# EAGLE schematic PR-Modem-PY (EAGLE 6.3)
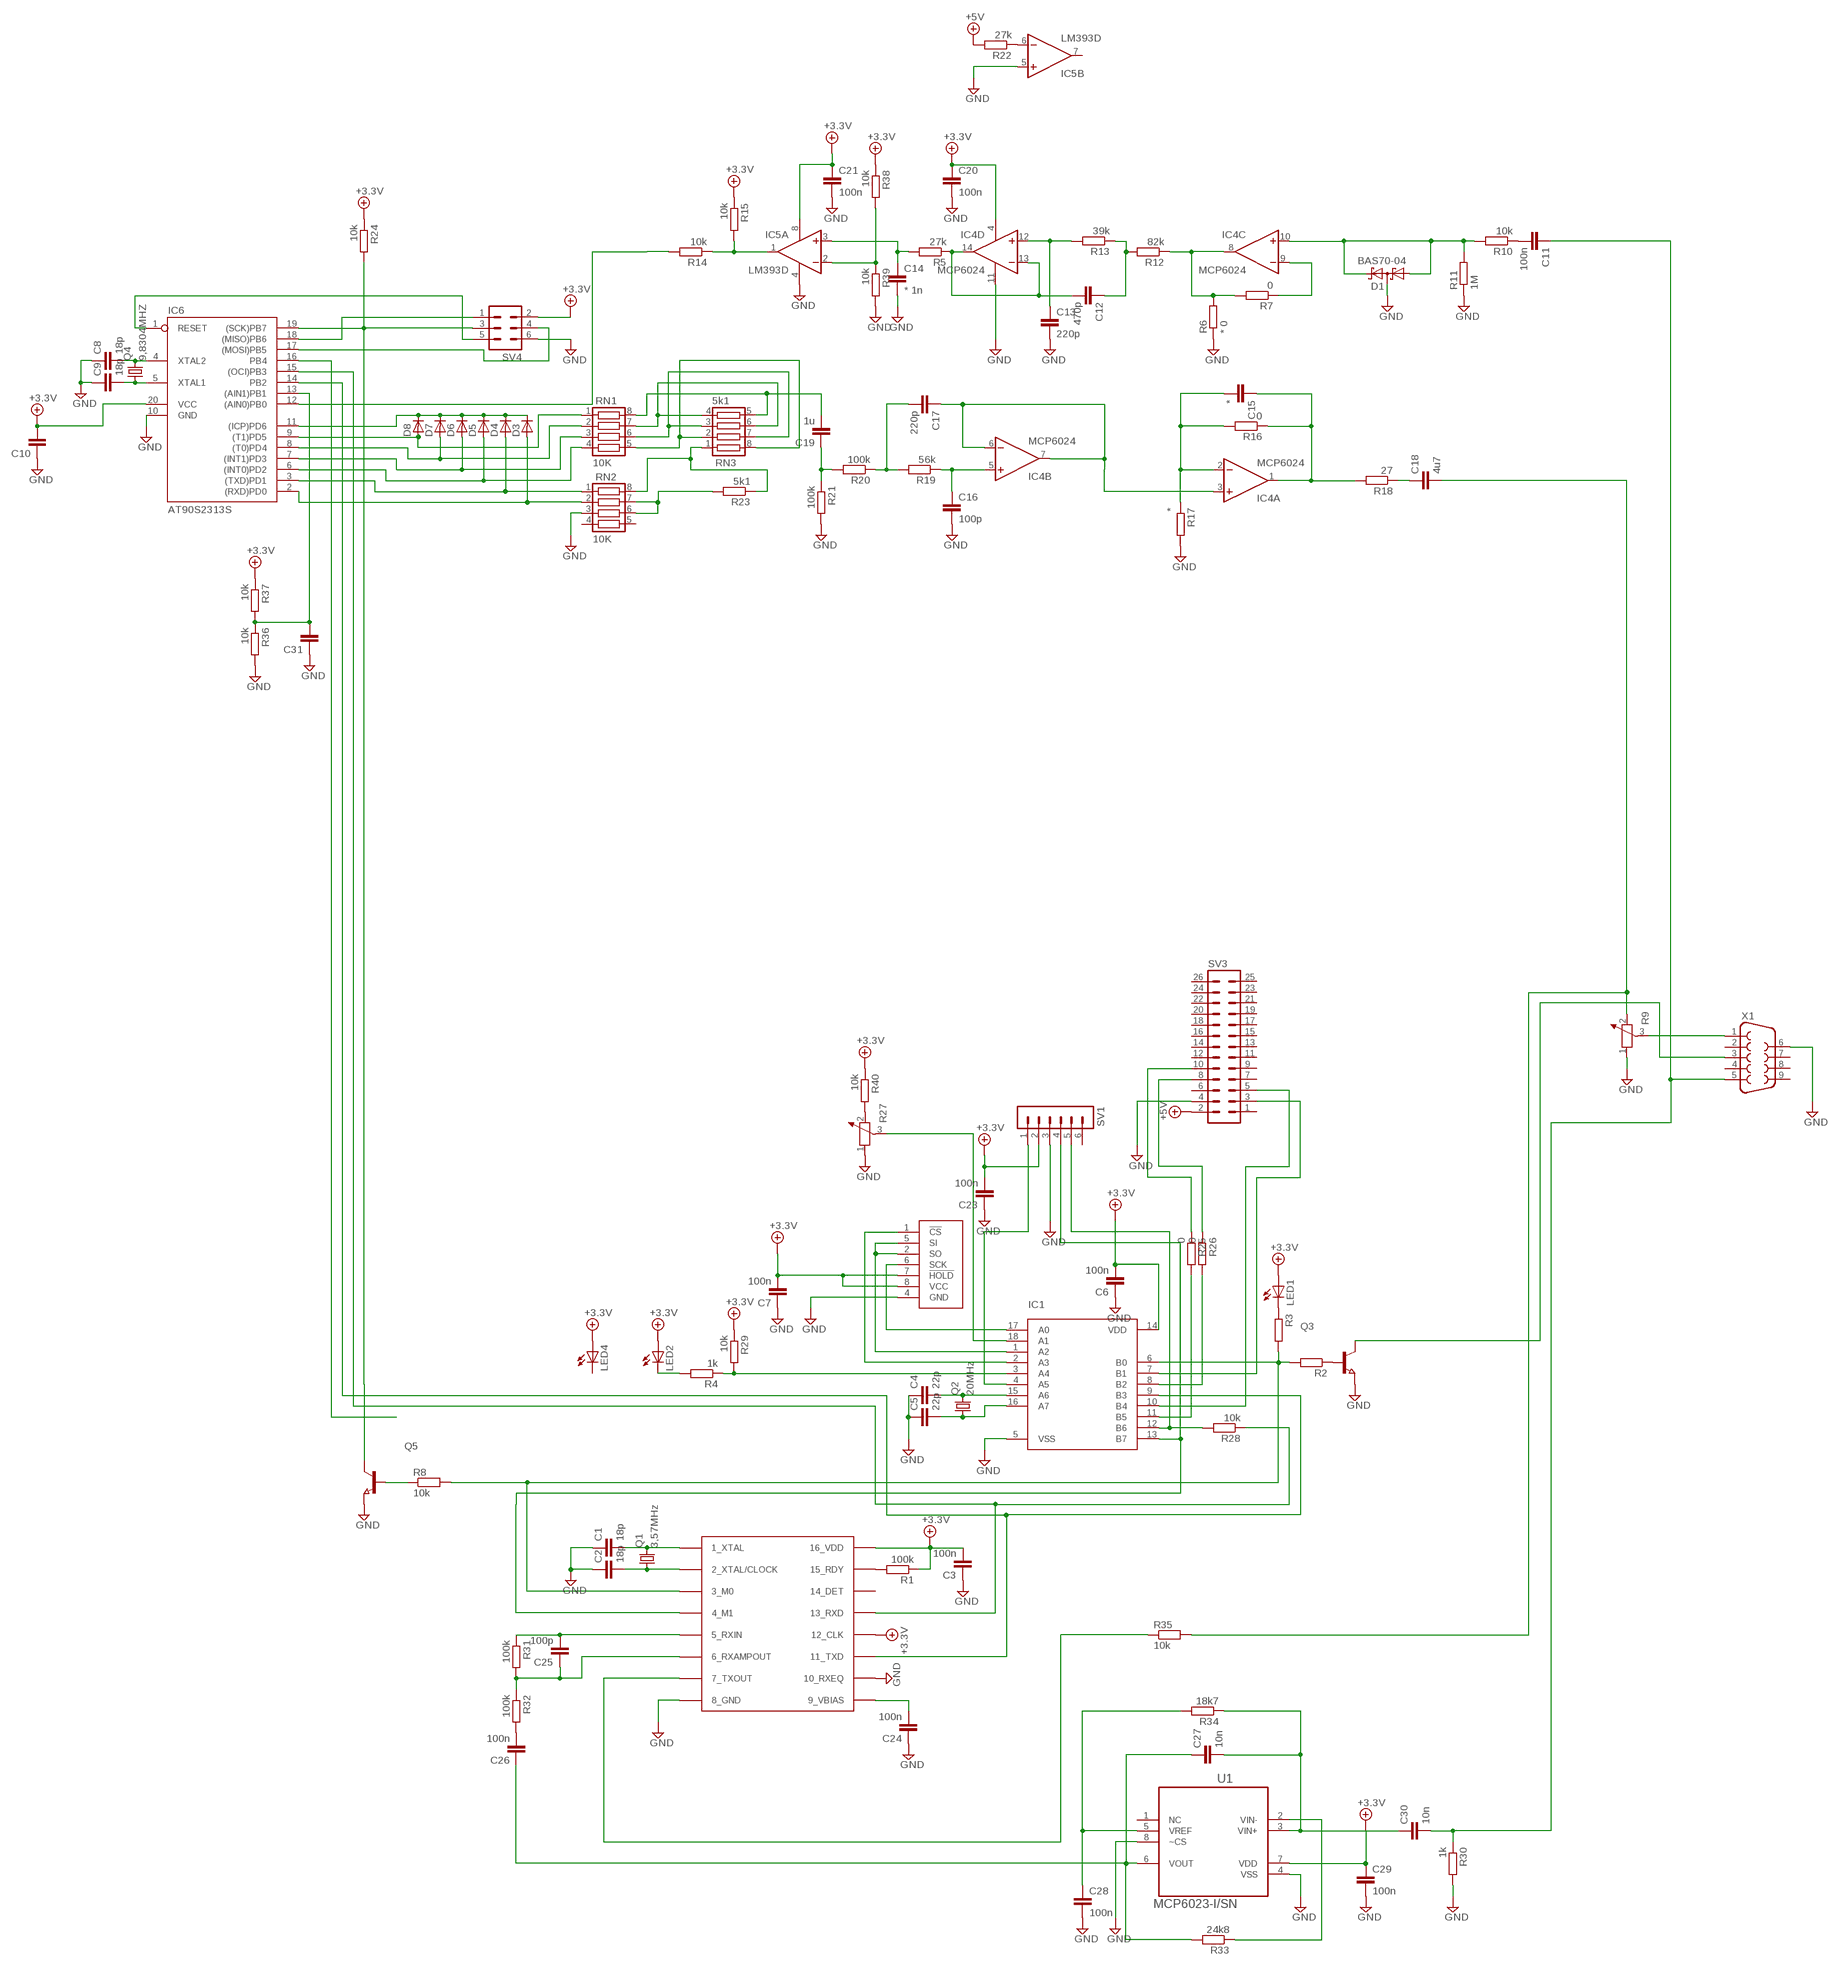
[diagram p0: schematic, sheet 1]

## Parts
C1  18p  C-EUC0603  [C0603]
C2  18p  C-EUC0603  [C0603]
C3  100n  C-EUC0603  [C0603]
C4  22p  C-EUC0603  [C0603]
C5  22p  C-EUC0603  [C0603]
C6  100n  C-EUC0603  [C0603]
C7  100n  C-EUC0603  [C0603]
C8  18p  C-EUC0603  [C0603]
C9  18p  C-EUC0603  [C0603]
C10  C-EUC0603  [C0603]
C11  100n  C-EUC0603  [C0603]
C12  470p  C-EUC0603  [C0603]
C13  220p  C-EUC0603  [C0603]
C14  * 1n  C-EUC0603  [C0603]
C15  *  C-EUC0603  [C0603]
C16  100p  C-EUC0603  [C0603]
C17  220p  C-EUC0603  [C0603]
C18  4u7  C-EUC1210  [C1210]
C19  1u  C-EUC1210  [C1210]
C20  100n  C-EUC0603  [C0603]
C21  100n  C-EUC0603  [C0603]
C23  100n  C-EUC0603  [C0603]
C24  100n  C-EUC0603  [C0603]
C25  100p  C-EUC0603  [C0603]
C26  100n  C-EUC0603  [C0603]
C27  10n  C-EUC0603  [C0603]
C28  100n  C-EUC0603  [C0603]
C29  100n  C-EUC0603  [C0603]
C30  10n  C-EUC0603  [C0603]
C31  C-EUC0603  [C0603]
D1  BAS70-04  [SOT23]
D3  D-SOD123  [SOD123]
D4  D-SOD123  [SOD123]
D5  D-SOD123  [SOD123]
D6  D-SOD123  [SOD123]
D7  D-SOD123  [SOD123]
D8  D-SOD123  [SOD123]
IC1  PIC16F18X7SO  [SOIC18-W]
IC4  MCP6024  TL064D  [SO14]
IC5  LM393D  [SO08]
IC6  AT90S2313S  [SO20L]
LED1  LED3MM  [LED3MM]
LED2  LED3MM  [LED3MM]
LED4  LED3MM  [LED3MM]
Q1  3,57MHz  CRYSTALHC49S  [HC49/S]
Q2  20MHz  CRYSTALHC49S  [HC49/S]
Q3  NPN-TRANSISTOR_SOT23  [SOT23]
Q4  9,8304MHZ  CRYSTALHC49S  [HC49/S]
Q5  NPN-TRANSISTOR_SOT23  [SOT23]
R1  100k  R-EU_R0603  [R0603]
R2  R-EU_R0603  [R0603]
R3  R-EU_R0603  [R0603]
R4  1k  R-EU_R0603  [R0603]
R5  27k  R-EU_R0603  [R0603]
R6  * 0  R-EU_R0603  [R0603]
R7  0  R-EU_R0603  [R0603]
R8  10k  R-EU_R0603  [R0603]
R9  POTENTIOMETER_PT-10  [PT-10]
R10  10k  R-EU_R0603  [R0603]
R11  1M  R-EU_R0603  [R0603]
R12  82k  R-EU_R0603  [R0603]
R13  39k  R-EU_R0603  [R0603]
R14  10k  R-EU_R0603  [R0603]
R15  10k  R-EU_R0603  [R0603]
R16  0  R-EU_R0603  [R0603]
R17  *  R-EU_R0603  [R0603]
R18  27  R-EU_R0603  [R0603]
R19  56k  R-EU_R0603  [R0603]
R20  100k  R-EU_R0603  [R0603]
R21  100k  R-EU_R0603  [R0603]
R22  27k  R-EU_R0603  [R0603]
R23  5k1  R-EU_R0603  [R0603]
R24  10k  R-EU_R0603  [R0603]
R25  0  R-EU_R0603  [R0603]
R26  0  R-EU_R0603  [R0603]
R27  POTENTIOMETER_PT-10  [PT-10]
R28  10k  R-EU_R0603  [R0603]
R29  10k  R-EU_R0603  [R0603]
R30  1k  R-EU_R0603  [R0603]
R31  100k  R-EU_R0603  [R0603]
R32  100k  R-EU_R0603  [R0603]
R33  24k8  R-EU_R0603  [R0603]
R34  18k7  R-EU_R0603  [R0603]
R35  10k  R-EU_R0603  [R0603]
R36  10k  R-EU_R0603  [R0603]
R37  10k  R-EU_R0603  [R0603]
R38  10k  R-EU_R0603  [R0603]
R39  10k  R-EU_R0603  [R0603]
R40  10k  R-EU_R0603  [R0603]
RN1  10K  CTS742C083  [CTS742C083]
RN2  10K  CTS742C083  [CTS742C083]
RN3  5k1  CTS742C083  [CTS742C083]
SV1  MA06-1  [MA06-1]
SV3  MA13-2  [MA13-2]
SV4  MA03-2  [MA03-2]
U1  MCP6023-I/SN  [SOIC127P600X175-8N]
U$1  23K640SN  [SOIC8]
U$2  MX614  [SOIC16-3]
X1  F09HP  [F09HP]

## Nets
+3.3V: C3.2 C6.2 C7.2 C10.2 C20.1 C21.1 C23.2 C29.1 IC1.14(VDD) IC4.4(P:V+) IC5.8(P:V+) IC6.20(VCC) LED1.A LED2.A LED4.A R1.1 R15.1 R24.1 R29.1 R37.1 R38.1 R40.1 SV1.2 SV4.2 U1.7(VDD) U$1.7(!HOLD) U$1.8(VCC) U$2.12(12_CLK) U$2.16(16_VDD)
+5V: R22.2 SV3.2
GND: C1.1 C2.1 C3.1 C4.1 C5.1 C6.1 C7.1 C8.1 C9.1 C10.1 C13.2 C14.2 C16.2 C20.2 C21.2 C23.1 C24.1 C28.2 C29.2 C31.1 D1.3(C1A2) IC1.5(VSS) IC4.11(P:V-) IC5.4(P:V-) IC5.5(B:+IN) IC6.10(GND) Q3.2(E) Q5.2(E) R6.1 R9.1 R11.1 R17.2 R21.2 R27.1 R30.2 R36.2 R39.2 RN2.3 SV1.3 SV3.4 SV4.6 U1.4(VSS) U1.8(~CS) U$1.4(GND) U$2.8(8_GND) U$2.10(10_RXEQ) X1.6
N$1: C1.2 Q1.2 U$2.1(1_XTAL)
N$2: C2.2 Q1.1 U$2.2(2_XTAL/CLOCK)
N$3: R1.2 U$2.15(15_RDY)
N$4: IC6.15((OCI)PB3) R28.1 U$2.13(13_RXD)
N$5: C4.2 IC1.15(A6) Q2.2
N$6: C8.2 IC6.4(XTAL2) Q4.2
N$7: C5.2 IC1.16(A7) Q2.1
N$8: C25.2 R31.1 U$2.5(5_RXIN)
N$9: IC1.1(A2) U$1.2(SO) U$1.5(SI)
N$10: IC1.2(A3) U$1.1(!CS)
N$11: IC1.17(A0) U$1.6(SCK)
N$12: IC1.9(B3) IC6.14(PB2) U$2.11(11_TXD)
N$13: Q3.1(B) R2.1
N$14: C25.1 R31.2 R32.1 U$2.6(6_RXAMPOUT)
N$15: LED1.K(C) R3.1
N$16: IC1.3(A4) R4.1 R29.2
N$17: LED2.K(C) R4.2
N$18: IC1.6(B0) R2.2 R3.2 R8.2 U$2.3(3_M0)
N$19: C9.2 IC6.5(XTAL1) Q4.1
N$20: IC1.13(B7) SV1.4 U$2.4(4_M1)
N$21: IC1.12(B6) R28.2 SV1.5
N$22: C11.2 R10.1
N$23: D1.1(A1) D1.2(C2) IC4.10(C:+IN) R10.2 R11.2
N$24: IC4.9(C:-IN) R7.1
N$25: IC4.8(C:OUT) R6.2 R7.2 R12.1
N$26: C14.1 IC5.3(A:+IN) R5.2
N$27: C12.1 R12.2 R13.1
N$28: C13.1 IC4.12(D:+IN) R13.2
N$29: C12.2 IC4.13(D:-IN) IC4.14(D:OUT) R5.1
N$30: IC5.1(A:OUT) R14.1 R15.2
N$31: C15.1 IC4.1(A:OUT) R16.1 R18.2
N$32: C15.2 IC4.2(A:-IN) R16.2 R17.1
N$33: C17.1 IC4.3(A:+IN) IC4.6(B:-IN) IC4.7(B:OUT)
N$34: R9.3 X1.1
N$35: C16.1 IC4.5(B:+IN) R19.1
N$36: C17.2 R19.2 R20.1
N$37: C19.1 R20.2 R21.1
N$38: C18.1 R18.1
N$39: IC5.6(B:-IN) R22.1
N$40: C19.2 RN1.8 RN3.5
N$41: RN1.7 RN3.4 RN3.6
N$42: RN1.6 RN3.3 RN3.7
N$43: RN1.5 RN3.2 RN3.8
N$44: R23.2 RN2.6 RN2.7
N$45: R23.1 RN2.8 RN3.1
N$46: D3.2(A) IC6.2((RXD)PD0) RN2.2
N$47: D4.2(A) IC6.3((TXD)PD1) RN2.1
N$48: D5.2(A) IC6.6((INT0)PD2) RN1.4
N$49: D6.2(A) IC6.7((INT1)PD3) RN1.3
N$50: D7.2(A) IC6.8((T0)PD4) RN1.2
N$51: D8.2(A) IC6.9((T1)PD5) RN1.1
N$52: D3.1(C) D4.1(C) D5.1(C) D6.1(C) D7.1(C) D8.1(C) IC6.11((ICP)PD6)
N$53: IC6.12((AIN0)PB0) R14.2
N$54: C24.2 U$2.9(9_VBIAS)
N$55: IC6.19((SCK)PB7) Q5.3(C) R24.2 SV4.3
N$56: C26.2 R32.2
N$57: IC5.2(A:-IN) R38.2 R39.1
N$58: Q5.1(B) R8.1
N$59: C11.1 C30.2 R30.1 X1.5
N$60: IC1.7(B1) SV3.3
N$61: IC1.10(B4) SV3.5
N$62: IC1.4(A5) SV1.1
N$63: C26.1 C27.1 R33.2 U1.6(VOUT)
N$64: R33.1 U1.2(VIN-)
N$65: C27.2 C30.1 R34.1 U1.3(VIN+)
N$66: C28.1 R34.2 U1.5(VREF)
N$67: C18.2 R9.2 R35.2
N$68: IC1.11(B5) R25.2
N$69: R35.1 U$2.7(7_TXOUT)
N$70: R25.1 SV3.10
N$71: IC6.18((MISO)PB6) SV4.1
N$72: IC6.1(RESET) SV4.5
N$73: IC6.17((MOSI)PB5) SV4.4
N$74: Q3.3(C) X1.3
N$75: IC1.8(B2) R26.2
N$76: C31.2 IC6.13((AIN1)PB1) R36.1 R37.2
N$77: IC6.16(PB4)
N$78: R26.1 SV3.8
N$79: R27.2 R40.2
N$80: IC1.18(A1) R27.3
Unconnected: IC5.7(B:OUT) LED4.K(C) RN2.4 RN2.5 SV1.6 SV3.1 SV3.6 SV3.7 SV3.9 SV3.11 SV3.12 SV3.13 SV3.14 SV3.15 SV3.16 SV3.17 SV3.18 SV3.19 SV3.20 SV3.21 SV3.22 SV3.23 SV3.24 SV3.25 SV3.26 U1.1(NC) U$2.14(14_DET) X1.2 X1.4 X1.7 X1.8 X1.9

## Library data of the parts
C1-C21 C23-C31 = rcl:C-EU: CAPACITOR, European symbol
D1 = diode:BAS70-04: Silicon Schottky Diodes General-purpose diode for high-speed switching
D3-D8 = semicon-smd-ipc:D-: DIODE unfilled
IC1 = AWJLEagleLib:PIC16F18X7: PIC16F1827/1847 extended mid-range MCU
IC4 = linear:TL064: OP AMP
IC5 = linear:LM393: COMPARATOR
IC6 = atmel:AT90S2313: MICROCONTROLLER 2 Kbytes FLASH 128 bytes SRAM 128 bytes EEPROM UART; OC_FARNELL: unknown; OC_NEWARK: unknown
LED1 LED2 LED4 = led:LED: LED OSRAM: - CHIPLED LG R971, LG N971, LY N971, LG Q971, LY Q971, LO R971, LY R971 LH N974, LH R974 LS Q976, LO Q976, LY Q976 LO Q996 - Hyper CHIPLED LW Q18S LB Q993, LB Q99A, LB R99A - SideLED LS A670, LO A670, LY A670, LG A670, LP A670 LB A673, LV A673, LT A673, LW A673 LH A674 LY A675 LS A676, LA A676, LO A676, LY A676, LW A676 LS A679, LY A679, LG A679 - Hyper Micro SIDELED® LS Y876, LA Y876, LO Y876, LY Y876 LT Y87S - SmartLED LW L88C, LW L88S LB L89C, LB L89S, LG L890 LS L89K, LO L89K, LY L89K LS L896, LA L896, LO L896, LY L896 - TOPLED LS T670, LO T670, LY T670, LG T670, LP T670 LSG T670, LSP T670, LSY T670, LOP T670, LYG T670 LG T671, LOG T671, LSG T671 LB T673, LV T673, LT T673, LW T673 LH T674 LS T676, LA T676, LO T676, LY T676, LB T676, LH T676, LSB T676, LW T676 LB T67C, LV T67C, LT T67C, LS T67K, LO T67K, LY T67K, LW E67C LS E67B, LA E67B, LO E67B, LY E67B, LB E67C, LV E67C, LT E67C LW T67C LS T679, LY T679, LG T679 LS T770, LO T770, LY T770, LG T770, LP T770 LB T773, LV T773, LT T773, LW T773 LH T774 LS E675, LA E675, LY E675, LS T675 LS T776, LA T776, LO T776, LY T776, LB T776 LHGB T686 LT T68C, LB T68C - Hyper Mini TOPLED® LB M676 - Mini TOPLED Santana® LG M470 LS M47K, LO M47K, LY M47K Source: http://www.osram.convergy.de LUXEON: - LUMILED® LXK2-PW12-R00, LXK2-PW12-S00, LXK2-PW14-U00, LXK2-PW14-V00 LXK2-PM12-R00, LXK2-PM12-S00, LXK2-PM14-U00 LXK2-PE12-Q00, LXK2-PE12-R00, LXK2-PE12-S00, LXK2-PE14-T00, LXK2-PE14-U00 LXK2-PB12-K00, LXK2-PB12-L00, LXK2-PB12-M00, LXK2-PB14-N00, LXK2-PB14-P00, LXK2-PB14-Q00 LXK2-PR12-L00, LXK2-PR12-M00, LXK2-PR14-Q00, LXK2-PR14-R00 LXK2-PD12-Q00, LXK2-PD12-R00, LXK2-PD12-S00 LXK2-PH12-R00, LXK2-PH12-S00 LXK2-PL12-P00, LXK2-PL12-Q00, LXK2-PL12-R00 Source: www.luxeon.com KINGBRIGHT: KA-3528ASYC Source: www.kingbright.com
Q1 Q2 Q4 = crystal:CRYSTAL: CRYSTAL; OC_FARNELL: 1667008; OC_NEWARK: unknown
Q3 Q5 = semicon-smd-ipc:NPN-TRANSISTOR_: NPN TRANSISTOR
R1-R8 R10-R26 R28-R40 = rcl:R-EU_: RESISTOR, European symbol
R9 R27 = rcl:POTENTIOMETER_: Potentiometer
RN1-RN3 = resistor-net:CTS742C083: Chip Resistor Array 4 Single Resistor Source: http://www.ctscorp.com/components/Datasheets/CTSChipArrayDs.pdf; OC_FARNELL: unknown; OC_NEWARK: unknown
SV1 = con-lstb:MA06-1: PIN HEADER; OC_FARNELL: unknown; OC_NEWARK: unknown
SV3 = con-lstb:MA13-2: PIN HEADER; OC_FARNELL: unknown; OC_NEWARK: unknown
SV4 = con-lstb:MA03-2: PIN HEADER; OC_FARNELL: unknown; OC_NEWARK: unknown
U1 = Microchip_By_element14_Batch_1:MCP6023-I/SN: IC OPAMP 2.5V R-R I/O; MPN: MCP6023-I/SN; OC_FARNELL: 1629353; OC_NEWARK: 92C2412; PACKAGE: 8 SOIC; SUPPLIER: Microchip
U$1 = SparkFun:23K640
U$2 = Ava:MX614
X1 = con-subd:F09: SUB-D; OC_FARNELL: unknown; OC_NEWARK: unknown